# EAGLE design dashboard (2) (EAGLE 9.4.1)
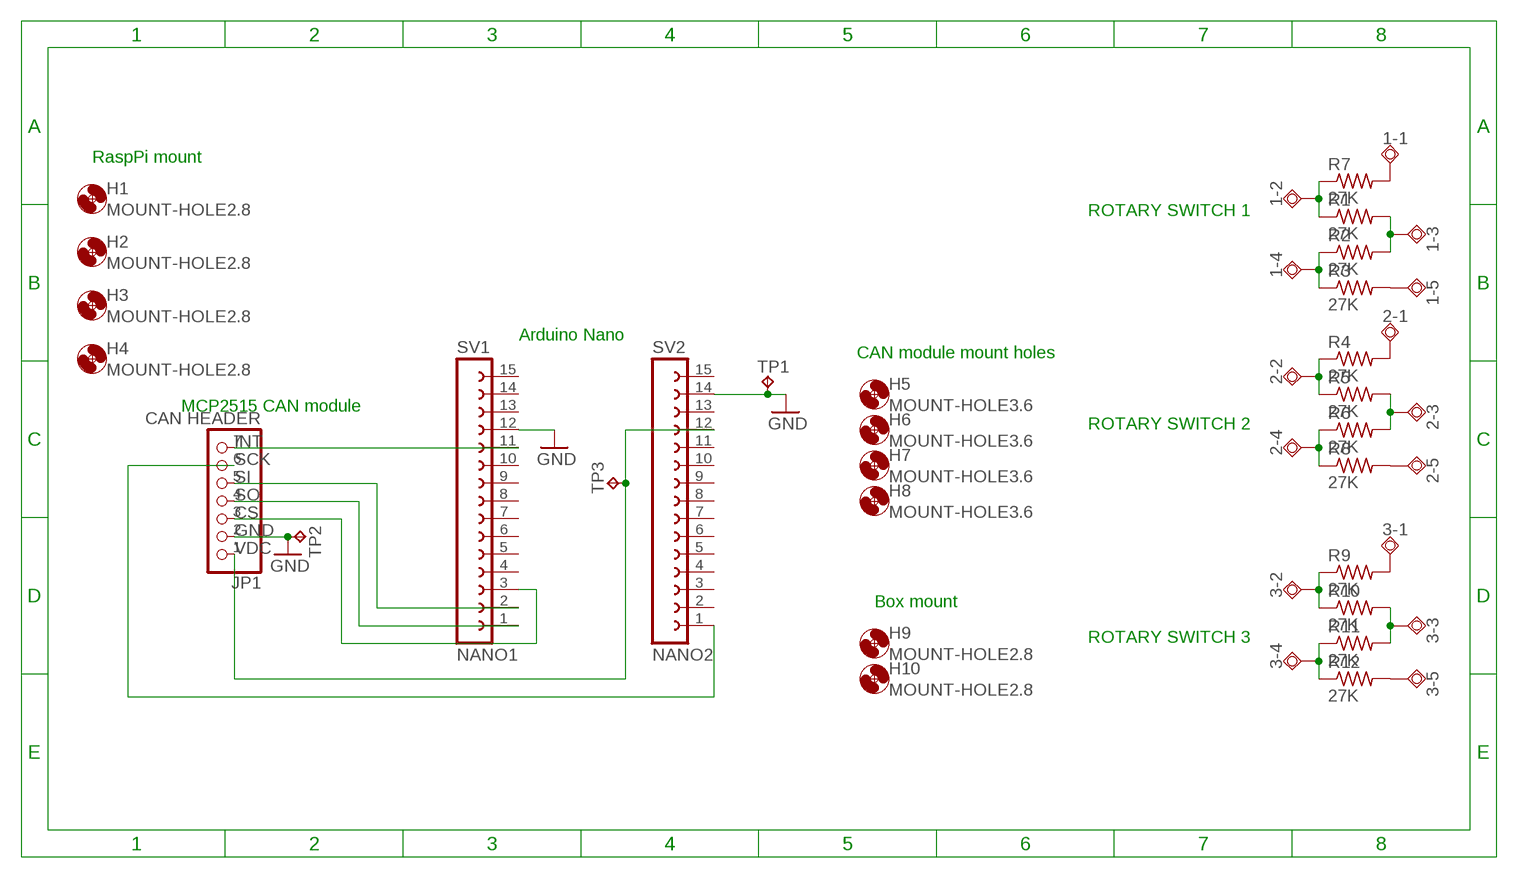
[diagram p0: schematic, sheet 1]

## Parts
1-1  TPSQPAD1-13Y  [P1-13Y]
1-2  TPSQPAD1-13  [P1-13]
1-3  TPSQPAD1-13  [P1-13]
1-4  TPSQPAD1-13  [P1-13]
1-5  TPSQPAD1-13Y  [P1-13Y]
2-1  TPSQPAD1-13Y  [P1-13Y]
2-2  TPSQPAD1-13  [P1-13]
2-3  TPSQPAD1-13  [P1-13]
2-4  TPSQPAD1-13  [P1-13]
2-5  TPSQPAD1-13Y  [P1-13Y]
3-1  TPSQPAD1-13Y  [P1-13Y]
3-2  TPSQPAD1-13  [P1-13]
3-3  TPSQPAD1-13  [P1-13]
3-4  TPSQPAD1-13  [P1-13]
3-5  TPSQPAD1-13Y  [P1-13Y]
H1  MOUNT-HOLE2.8  [2,8]
H2  MOUNT-HOLE2.8  [2,8]
H3  MOUNT-HOLE2.8  [2,8]
H4  MOUNT-HOLE2.8  [2,8]
H5  MOUNT-HOLE3.6  [3,6]
H6  MOUNT-HOLE3.6  [3,6]
H7  MOUNT-HOLE3.6  [3,6]
H8  MOUNT-HOLE3.6  [3,6]
H9  MOUNT-HOLE2.8  [2,8]
H10  MOUNT-HOLE2.8  [2,8]
JP1  CAN HEADER  PINHD-1X7M  [1X07M]
R1  27K  R-US_0309/10  [0309/10]
R2  27K  R-US_0309/10  [0309/10]
R3  27K  R-US_0309/10  [0309/10]
R4  27K  R-US_0309/10  [0309/10]
R5  27K  R-US_0309/10  [0309/10]
R6  27K  R-US_0309/10  [0309/10]
R7  27K  R-US_0309/10  [0309/10]
R8  27K  R-US_0309/10  [0309/10]
R9  27K  R-US_0309/10  [0309/10]
R10  27K  R-US_0309/10  [0309/10]
R11  27K  R-US_0309/10  [0309/10]
R12  27K  R-US_0309/10  [0309/10]
SV1  NANO1  FE15-1  [FE15]
SV2  NANO2  FE15-1  [FE15]
TP1  TPTP20SQ  [TP20SQ]
TP2  TPTP20SQ  [TP20SQ]
TP3  TPTP20SQ  [TP20SQ]

## Nets
2-2: 2-2.1(TP) R4.1 R5.1
CS: JP1.3 SV1.3
GND: JP1.2 SV1.12 SV2.14 TP1.TP TP2.TP
INT: JP1.7 SV1.11
N$1: 1-1.1(TP) R7.2
N$2: 1-4.1(TP) R2.1 R3.1
N$4: 2-3.1(TP) R5.2 R6.2
N$5: 2-1.1(TP) R4.2
N$6: 3-1.1(TP) R9.2
N$7: 1-2.1(TP) R1.1 R7.1
N$8: 1-3.1(TP) R1.2 R2.2
N$9: 2-4.1(TP) R6.1 R8.1
N$10: 3-2.1(TP) R9.1 R10.1
N$11: 3-3.1(TP) R10.2 R11.2
N$12: 3-4.1(TP) R11.1 R12.1
N$13: 2-5.1(TP) R8.2
N$14: 1-5.1(TP) R3.2
N$15: 3-5.1(TP) R12.2
SCK: JP1.6 SV2.1
SI: JP1.5 SV1.2
SO: JP1.4 SV1.1
VDC: JP1.1 SV2.12 TP3.TP
Unconnected: SV1.4 SV1.5 SV1.6 SV1.7 SV1.8 SV1.9 SV1.10 SV1.13 SV1.14 SV1.15 SV2.2 SV2.3 SV2.4 SV2.5 SV2.6 SV2.7 SV2.8 SV2.9 SV2.10 SV2.11 SV2.13 SV2.15

## Notes on the sheet
- RaspPi mount
- ROTARY SWITCH 1
- Arduino Nano
- CAN module mount holes
- MCP2515 CAN module
- ROTARY SWITCH 2
- Box mount
- ROTARY SWITCH 3

## Library data of the parts
1-1-1-5 2-1-2-5 3-1-3-5 = testpad:TPSQ: Test pad
H1-H10 = holes:MOUNT-HOLE: MOUNTING HOLE with drill center marker
JP1 = pinhead:PINHD-1X7: PIN HEADER
R1-R12 = ECE2240+Project:R-US_: RESISTOR, American symbol
SV1 SV2 = con-lsta:FE15-1: FEMALE HEADER; OC_FARNELL: unknown; OC_NEWARK: unknown
TP1-TP3 = testpad:TP: Test pad

## Board
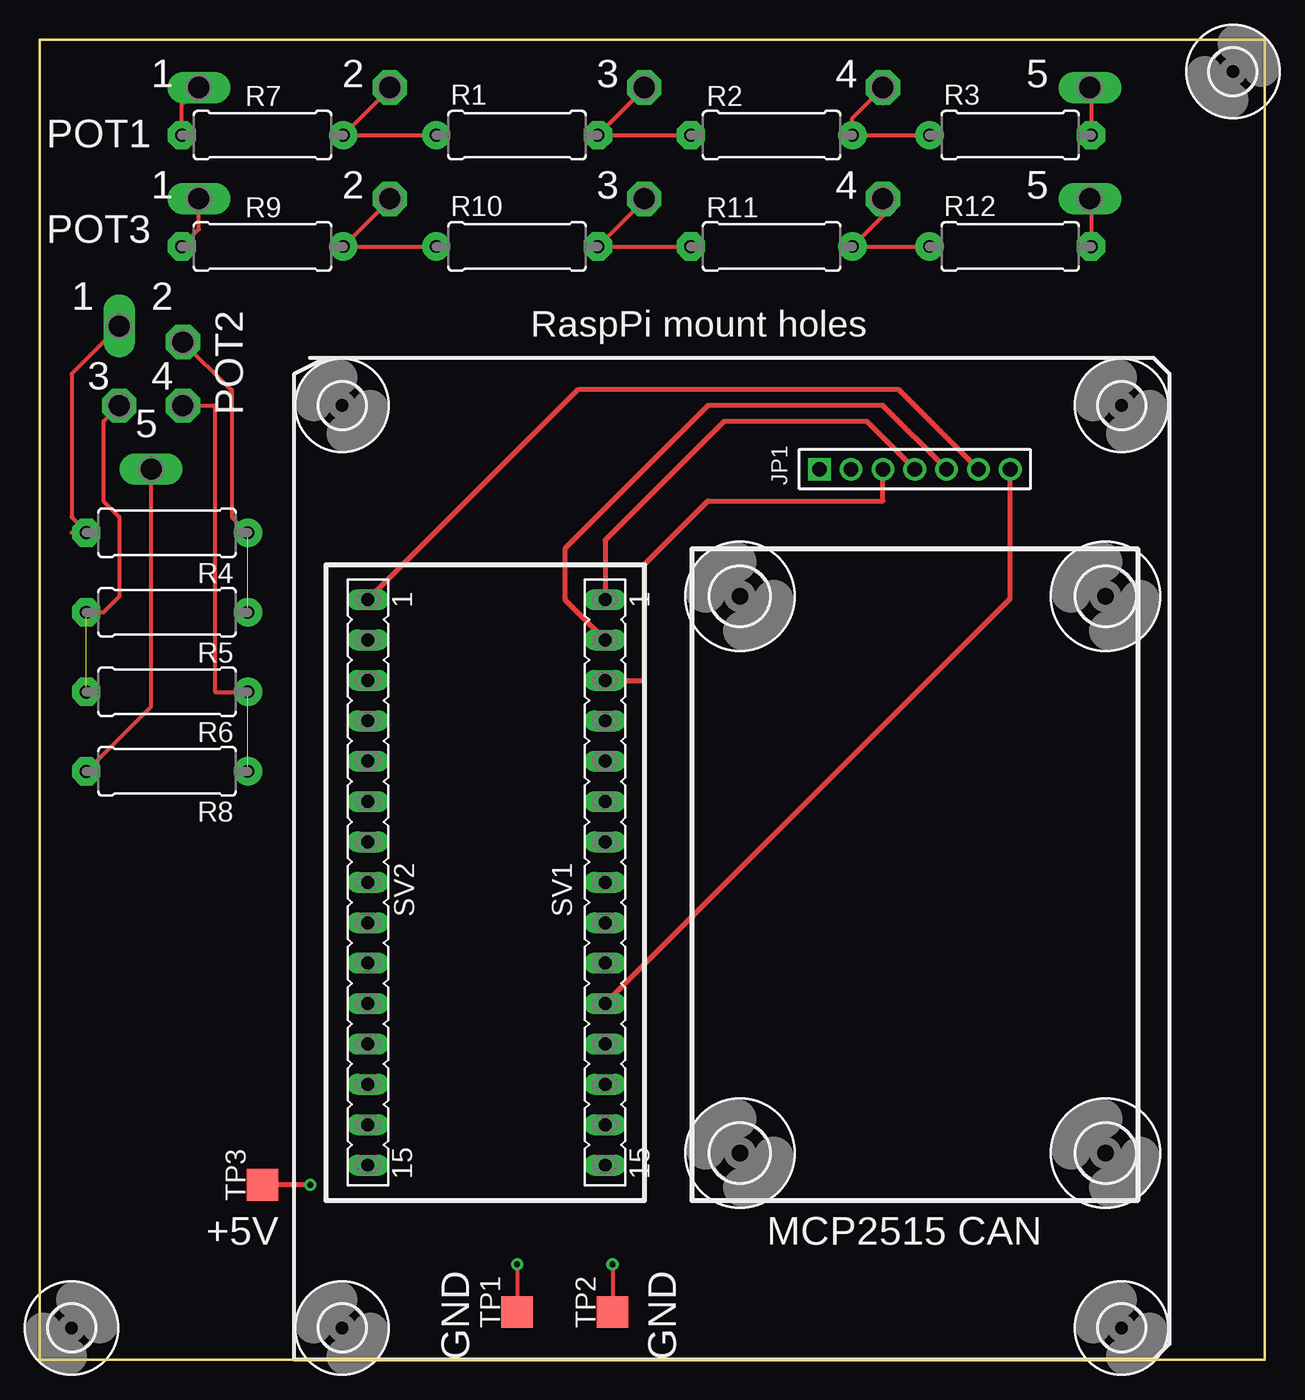
[diagram p1: board, top side]
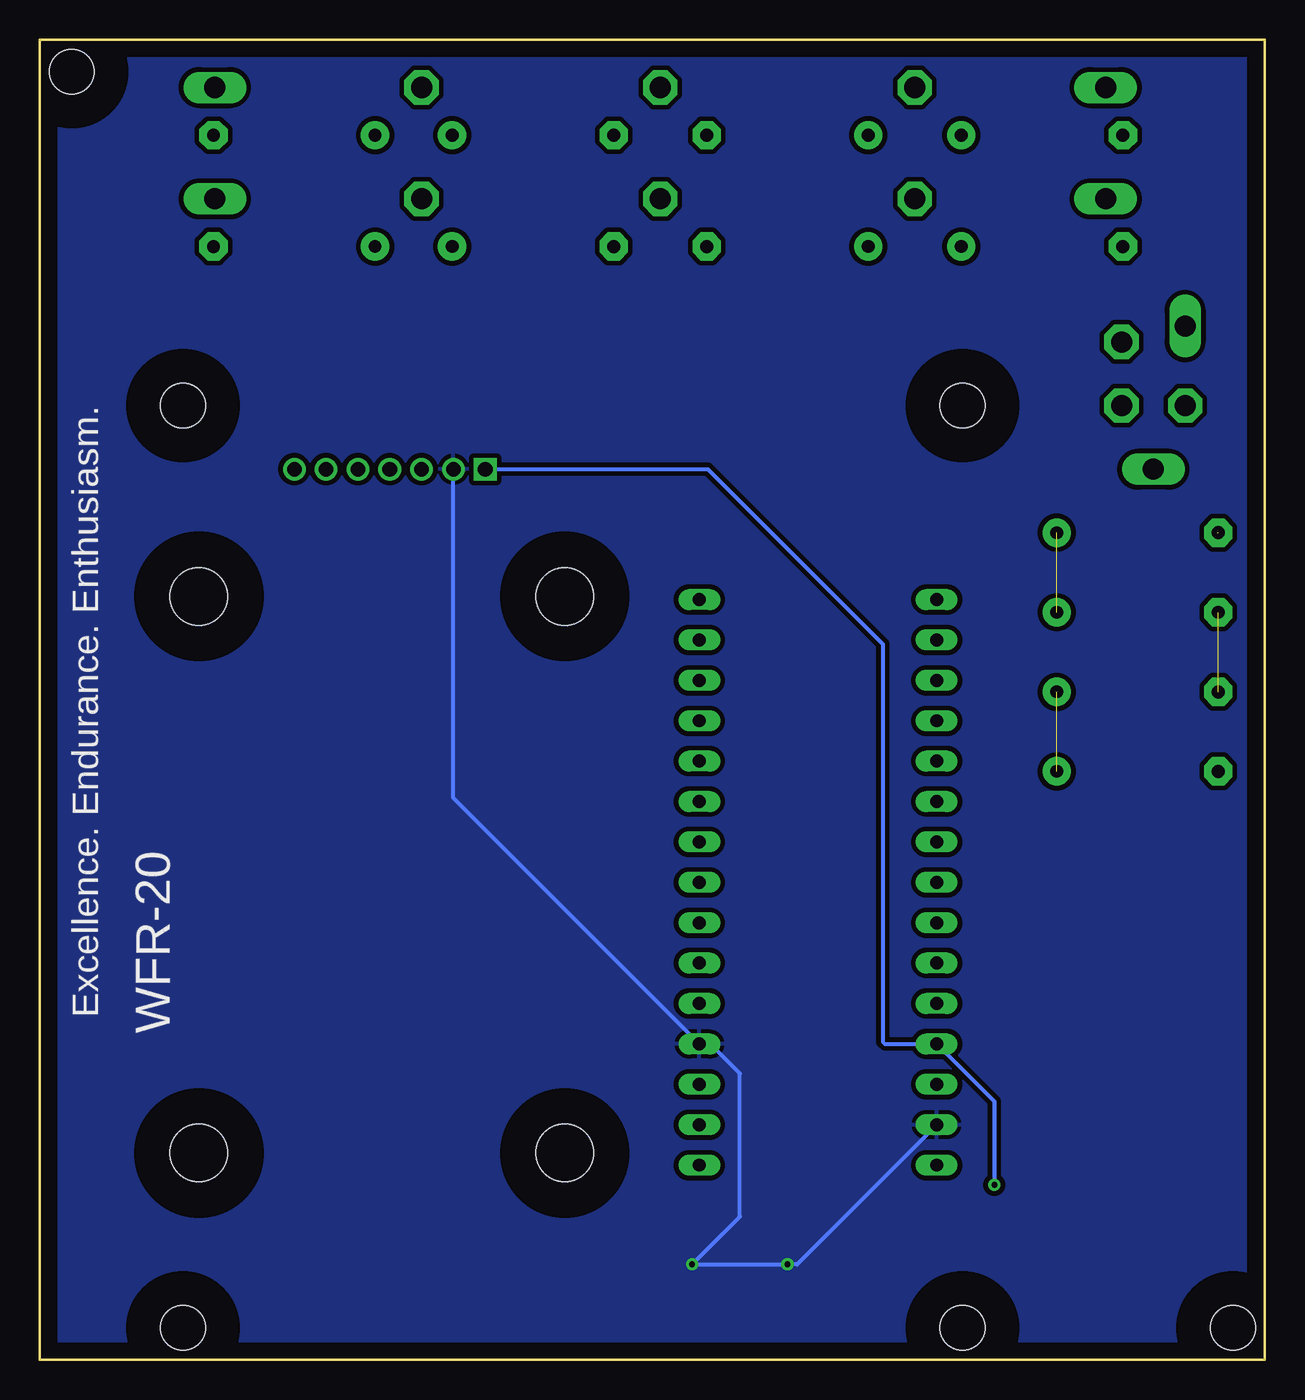
[diagram p2: board, bottom side, seen from below]

Size 77 x 83 mm. Coordinates in mm from the lower left corner, seen from the top.
Outline: 0,83 77,83 77,0 0,0 0,83
Copper layers (1*16): Top 0.035mm / dielectric 1.5mm / Bottom 0.035mm
Design rules "default *": minimum track width 6mil, minimum drill 0.35mm, track to track 12mil, track to pad 12mil, pad to pad 8mil, via to via 8mil, smd to smd 8mil, copper to edge 40mil, drill to drill 6mil, minimum pad ring 10mil, minimum via ring 8mil, stop-mask expansion 4mil, vias tented up to drill 0mil, thermal gap 10mil

### Footprints (pad centres in the part's own frame; a part is rotated, then mirrored left to right if it is on the bottom)
P1-13Y = drill 1.321 pad 1.905 long: 1 0,0
P1-13 = drill 1.321 pad 2.159 octagon: 1 0,0
2,8 = hole 2.8: 0,0
3,6 = hole 3.6: 0,0
1X07M = drill 0.914 square: 1 -6,0 | drill 0.914: 2 -4,0; 3 -2,0; 4 0,0; 5 2,0; 6 4,0; 7 6,0
0309/10 = drill 0.8 pad 1.778: 1 -5.08,0 | drill 0.813 pad 1.778 octagon: 2 5.08,0
FE15 = drill 0.813 long: 1 -17.78,0; 2 -15.24,0; 3 -12.7,0; 4 -10.16,0; 5 -7.62,0; 6 -5.08,0; 7 -2.54,0; 8 0,0; 9 2.54,0; 10 5.08,0; 11 7.62,0; 12 10.16,0; 13 12.7,0; 14 15.24,0; 15 17.78,0
TP20SQ = smd 2 x 2: TP 0,0

### Placement (x,y rotation side)
1-1  10,80 90 top
1-2  22,80 0 top
1-3  38,80 0 top
1-4  53,80 0 top
1-5  66,80 90 top
2-1  5,65 180 top
2-2  9,64 0 top
2-3  5,60 0 top
2-4  9,60 0 top
2-5  7,56 270 top
3-1  10,73 90 top
3-2  22,73 0 top
3-3  38,73 0 top
3-4  53,73 0 top
3-5  66,73 90 top
H1  19,2 90 top
H2  19,60 90 top
H3  68,2 90 top
H4  68,60 90 top
H5  67,13 90 top
H6  67,48 90 top
H7  44,13 90 top
H8  44,48 90 top
H9  2,2 0 top
H10  75,81 0 top
JP1  55,56 0 top
R1  30,77 0 top
R2  46,77 180 top
R3  61,77 0 top
R4  8,52 180 top
R5  8,47 180 top
R6  8,42 180 top
R7  14,77 180 top
R8  8,37 180 top
R9  14,70 180 top
R10  30,70 0 top
R11  46,70 180 top
R12  61,70 0 top
SV1  35.54,30.02 270 top
SV2  20.62,30.02 270 top
TP1  30,3 90 top
TP2  36,3 90 top
TP3  14,11 90 top

### Tracks (layer width: path | path; a pad name or v marks a point on that pad's centre or on a via)
2-2  (1 unrouted)
  Top 0.254: 2-2.1 12,61 12.08,61 12.08,53 R4.1
CS
  Top 0.305: SV1.3 38,42.72 38,50 42,54 53,54 JP1.3
GND  (via drill 0.35)
  Top 0.254: v30,6 TP1.TP | v36,6 TP2.TP
  Bottom 0.254: SV2.14 29.4,6 v30,6 v36,6 33,9 33,18 34.86,19.86 SV1.12 51,35.32 JP1.2
  pour Bottom: 0,83 77,83 77,0 0,0
INT
  Top 0.305: SV1.11 61,47.86 JP1.7
N$1
  Top 0.254: R7.2 8.92,78.92 1-1.1
N$2
  Top 0.203: 1-4.1 53,78.92
  Top 0.254: R3.1 R2.1 51.08,78.08 1-4.1
N$4  (1 unrouted)
  Top 0.254: 2.22,47 R5.2 4,47 5,48 5,53 4,54 4,59 2-3.1
N$5  (1 unrouted)
  Top 0.254: 2,52 3,52 2,53 2,62 2-1.1
N$6
  Top 0.254: R9.2 10,71.08 3-1.1
N$7
  Top 0.203: 19.08,77.08 R7.1
  Top 0.254: 1-2.1 22,79.92 R7.1 R1.1
N$8
  Top 0.203: 35.08,77.08 R1.2
  Top 0.254: R2.2 R1.2 38,79.92 1-3.1
N$9  (1 unrouted)
  Top 0.254: 2-4.1 11,60 11,42 R6.1
N$10
  Top 0.254: R10.1 R9.1 22,72.92 3-2.1
N$11
  Top 0.203: R10.2 35.08,70.08
  Top 0.254: R11.2 R10.2 38,72.92 3-3.1
N$12
  Top 0.254: R12.1 R11.1 53,71.92 3-4.1
N$13
  Top 0.254: R8.2 7,41.08 2-5.1
N$14
  Top 0.203: 66,77.08 R3.2
  Top 0.254: 1-5.1 66.08,79.92 R3.2
N$15
  Top 0.254: 3-5.1 66.08,72.92 R12.2
SCK
  Top 0.305: JP1.6 54,61 33.82,61 SV2.1
SI
  Top 0.305: JP1.5 53,60 42,60 33,51 33,47.8 SV1.2
SO
  Top 0.305: JP1.4 52,59 43,59 35.54,51.54 SV1.1
VDC  (via drill 0.35)
  Top 0.305: v17,11 TP3.TP
  Bottom 0.254: JP1.1 35,56 24,45 24,20 23.86,19.86 SV2.12 17,16.24 v17,11

### Text on the board
tPlace: RaspPi mount holes | +5V | MCP2515 CAN | GND | GND
tNames: 1 | 2 | 3 | 4 | 5 | POT1 | 1 | 2 | 3 | 4 | 5 | POT3 | 1 | 2 | POT2 | 3 | 4 | 5
bNames: Excellence. Endurance. Enthusiasm. | WFR-20
tValues: VCC | GND | CS | SO | SI | SCK | INT | MINI USB | PINOUT SIDE | D13 | D12 | D11 | D10 | D2 | 5V | GND | GND | VIN | ARDUINO NANO